# EAGLE design UVBoardFlippingGND (EAGLE 9.5.1)

## Sheet 1 of 2
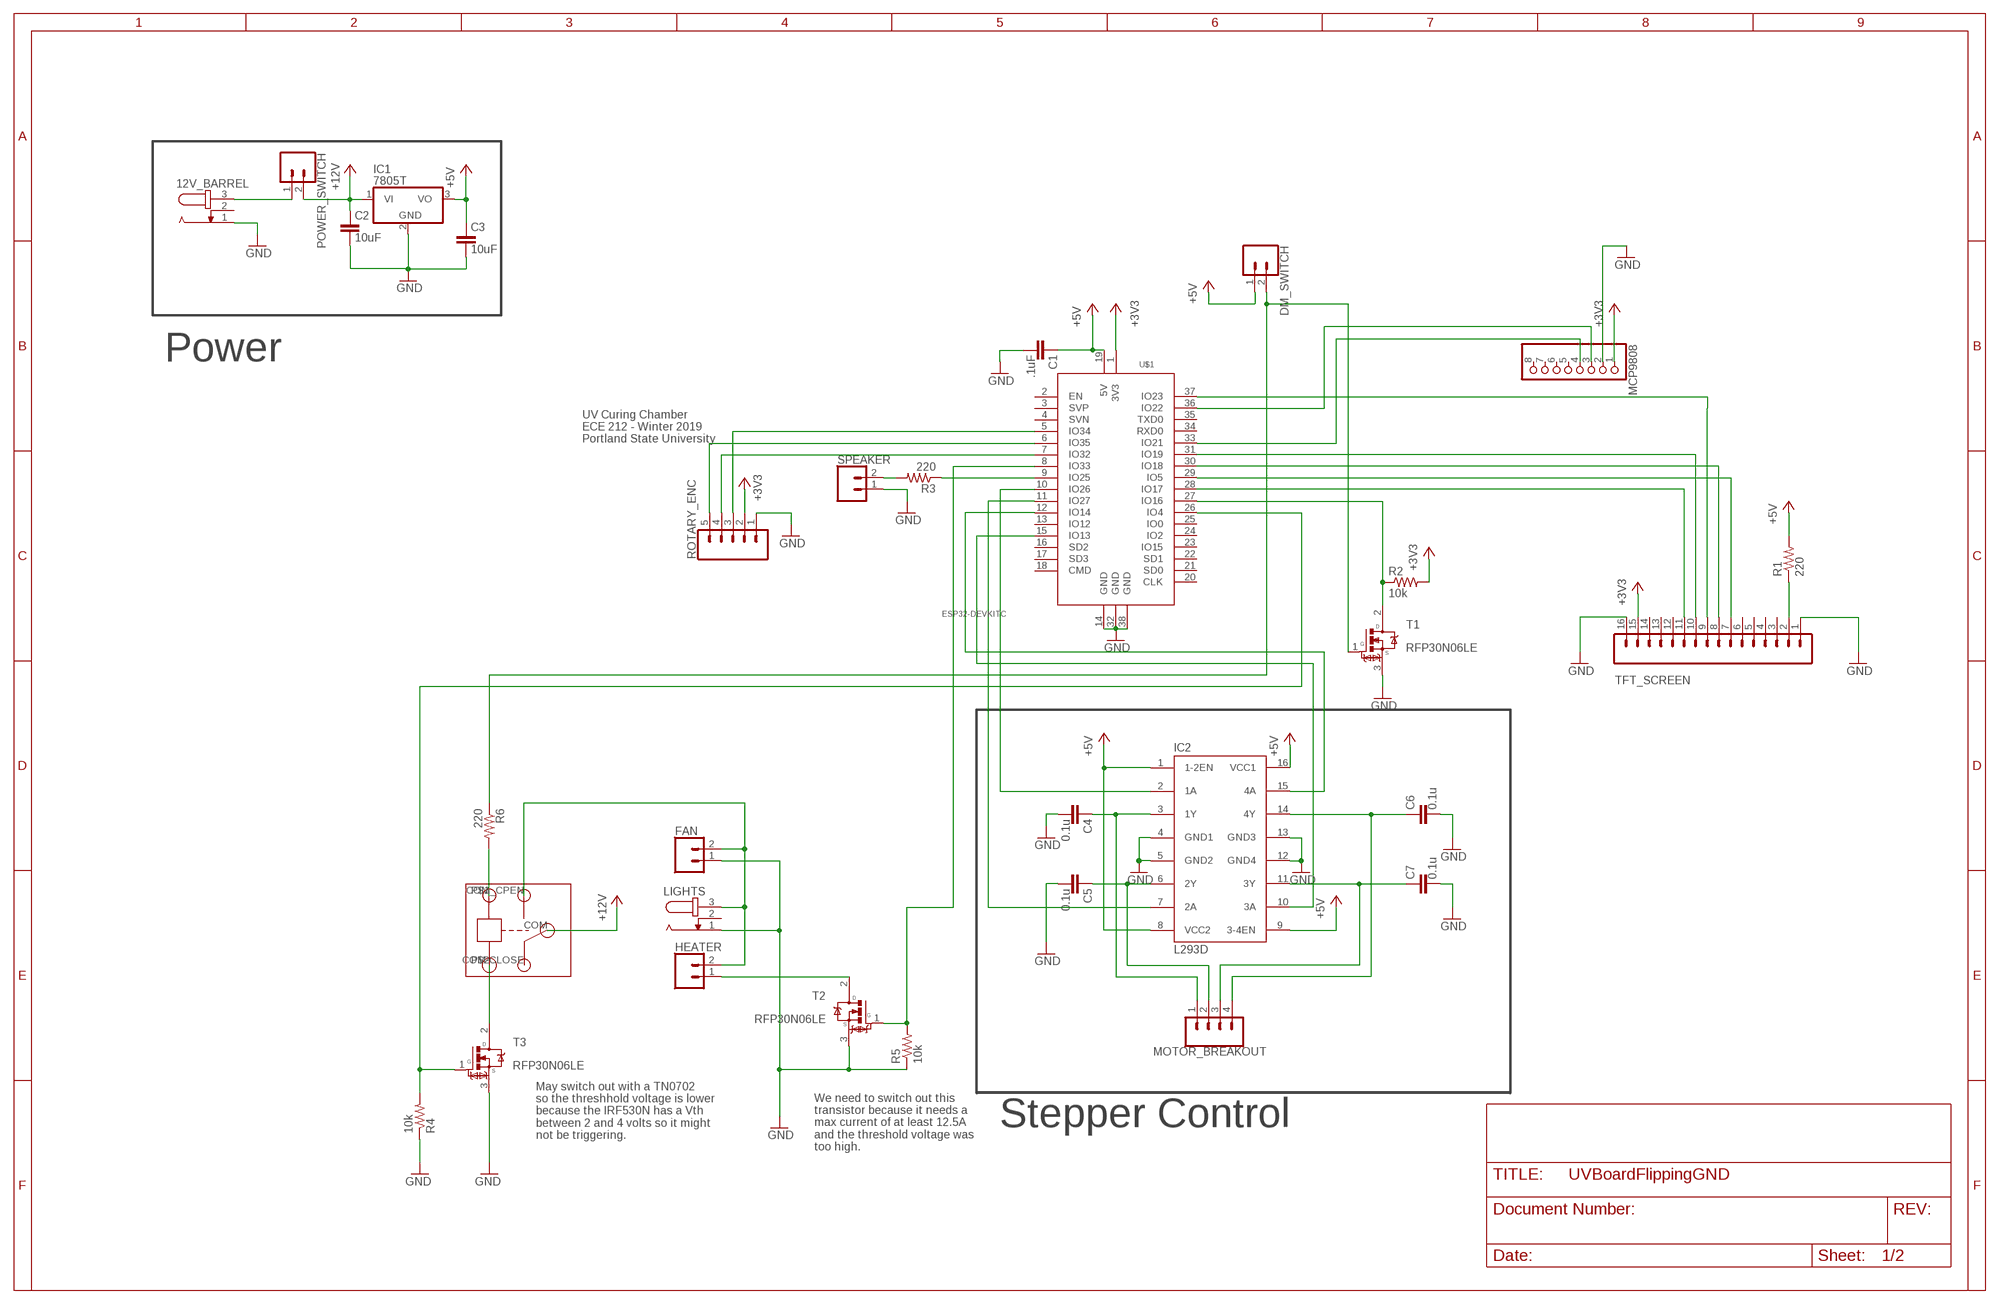
[diagram p0: schematic, sheet 1]

### Parts
12V_BARREL  JACK-PLUG0  [SPC4077]
C1  .1uF  C-EUC0603  [C0603]
C2  10uF  C-EUC1206  [C1206]
C3  10uF  C-EUC1206  [C1206]
C4  0.1u  C-EUC0603  [C0603]
C5  0.1u  C-EUC0603  [C0603]
C6  0.1u  C-EUC0603  [C0603]
C7  0.1u  C-EUC0603  [C0603]
DM_SWITCH  CONN_025MM  [SCREWTERMINAL-5MM-2]
FAN  CONN_025MM  [SCREWTERMINAL-5MM-2]
HEATER  CONN_025MM  [SCREWTERMINAL-5MM-2]
IC1  7805T  [TO220H]
IC2  L293D  [DIL16]
LIGHTS  JACK-PLUG0  [SPC4077]
MCP9808  PINHD-1X8BIG  [1X08-BIG]
MOTOR_BREAKOUT  CONN_04SCREW  [SCREWTERMINAL-3.5MM-4]
POWER_SWITCH  CONN_025MM  [SCREWTERMINAL-5MM-2]
R1  220  R-US_R0805  [R0805]
R2  10k  R-US_R0805  [R0805]
R3  220  R-US_R0805  [R0805]
R4  10k  R-US_R0805  [R0805]
R5  10k  R-US_R0805  [R0805]
R6  220  R-US_R0805  [R0805]
ROTARY_ENC  CONN_05  [1X05]
SPEAKER  CONN_025MM  [SCREWTERMINAL-5MM-2]
T1  RFP30N06LE  [TRANS_RFP30N06LE]
T2  RFP30N06LE  [TRANS_RFP30N06LE]
T3  RFP30N06LE  [TRANS_RFP30N06LE]
TFT_SCREEN  CONN_16  [1X16]
U$1  ESP32DEVKITC  [ESP32-DEVKITC]
U$2  RELAY  [RELAY]

### Nets
+3V3: MCP9808.1 R2.2 ROTARY_ENC.2 TFT_SCREEN.15 U$1.1(3V3)
+5V: C1.1 C3.1 DM_SWITCH.1 IC1.3(VO) IC2.1(1-2EN) IC2.8(VCC2) IC2.9(3-4EN) IC2.16(VCC1) R1.2 U$1.19(5V)
ASDSFA [thick]: C2.1 IC1.1(VI) POWER_SWITCH.2 U$2.COM ; supply symbol labelled +12V
GND: 12V_BARREL.1 C1.2 C2.2 C3.2 C4.2 C5.2 C6.2 C7.2 FAN.1 IC1.2(GND) IC2.4(GND1) IC2.5(GND2) IC2.12(GND4) IC2.13(GND3) LIGHTS.1 MCP9808.2 R4.1 R5.1 ROTARY_ENC.1 SPEAKER.1 T1.3(S) T2.3(S) T3.3(S) TFT_SCREEN.1 TFT_SCREEN.16 U$1.14(GND) U$1.32(GND) U$1.38(GND)
N$1: TFT_SCREEN.9 U$1.37(IO23)
N$2: IC2.15(4A) U$1.12(IO14)
N$3 [thick]: 12V_BARREL.3 POWER_SWITCH.1
N$4: HEATER.1 T2.2(D)
N$5: IC2.7(2A) U$1.11(IO27)
N$6: R3.2 SPEAKER.2
N$7: C5.1 IC2.6(2Y) MOTOR_BREAKOUT.2
N$8: DM_SWITCH.2 R6.1 T1.1(G)
N$9: R2.1 T1.2(D) U$1.27(IO16)
N$10: MCP9808.3 U$1.36(IO22)
N$11: MCP9808.4 U$1.33(IO21)
N$13: IC2.2(1A) U$1.10(IO26)
N$14: R5.2 T2.1(G) U$1.8(IO33)
N$15: C4.1 IC2.3(1Y) MOTOR_BREAKOUT.1
N$16: R4.2 T3.1(G) U$1.26(IO4)
N$17: R1.1 TFT_SCREEN.2
N$18: ROTARY_ENC.3 U$1.5(IO34)
N$19: ROTARY_ENC.4 U$1.7(IO32)
N$20: ROTARY_ENC.5 U$1.6(IO35)
N$21: TFT_SCREEN.11 U$1.28(IO17)
N$22: TFT_SCREEN.10 U$1.31(IO19)
N$23: C7.1 IC2.11(3Y) MOTOR_BREAKOUT.3
N$24: TFT_SCREEN.8 U$1.30(IO18)
N$25: TFT_SCREEN.7 U$1.29(IO5)
N$26: R3.1 U$1.9(IO25)
N$27: C6.1 IC2.14(4Y) MOTOR_BREAKOUT.4
N$28 [thick]: FAN.2 HEATER.2 LIGHTS.3 U$2.COM_CPEN(COM-OPEN)
N$29: IC2.10(3A) U$1.15(IO13)
N$31: T3.2(D) U$2.P$2(GND)
N$32: R6.2 U$2.P$1(IN)
Unconnected: 12V_BARREL.2 LIGHTS.2 MCP9808.5 MCP9808.6 MCP9808.7 MCP9808.8 TFT_SCREEN.3 TFT_SCREEN.4 TFT_SCREEN.5 TFT_SCREEN.6 TFT_SCREEN.12 TFT_SCREEN.13 TFT_SCREEN.14 U$1.2(EN) U$1.3(SVP) U$1.4(SVN) U$1.13(IO12) U$1.16(SD2) U$1.17(SD3) U$1.18(CMD) U$1.20(CLK) U$1.21(SD0) U$1.22(SD1) U$1.23(IO15) U$1.24(IO2) U$1.25(IO0) U$1.34(RXD0) U$1.35(TXD0) U$2.COM-CLOSE

### Notes on the sheet
- Power
- UV Curing Chamber
  ECE 212 - Winter 2019
  Portland State University
- Stepper Control
- May switch out with a TN0702
  so the threshhold voltage is lower
  because the IRF530N has a Vth
  between 2 and 4 volts so it might
  not be triggering.
- We need to switch out this
  transistor because it needs a
  max current of at least 12.5A
  and the threshold voltage was
  too high.

## Sheet 2 of 2

## Library data of the parts
12V_BARREL LIGHTS = con-jack:JACK-PLUG: DC POWER JACK Power Jack, DC, Right Angle, Through Hole, Rated 5A at 16VDC, PC Terminals Distributor: Farnell (www.Farnell.de) Drawing: 84N1161.pdf / 84N1162.pdf Manufacturer: SPC Technology (www.spctechnology.com) Type: SPC4077 / SPC 4078; OC_FARNELL: unknown; OC_NEWARK: unknown
C1-C7 = rcl:C-EU: CAPACITOR, European symbol; SPICEPREFIX: C
DM_SWITCH FAN HEATER POWER_SWITCH SPEAKER = SparkFun-Connectors:CONN_02: Multi connection point. Often used as Generic Header-pin footprint for 0.1 inch spaced/style header connections On any of the 0.1 inch spaced packages, you can populate with these: Break Away Headers - Straight <https://www.sparkfun.com/products/116> (PRT-00116) Break Away Male Headers - Right Angle <https://www.sparkfun.com/products/553> (PRT-00553) Female Headers <https://www.sparkfun.com/products/115> (PRT-00115) Break Away Headers - Machine Pin <https://www.sparkfun.com/products/117> (PRT-00117) Break Away Female Headers - Swiss Machine Pin <https://www.sparkfun.com/products/743> (PRT-00743) For SCREWTERMINALS and SPRING TERMINALS visit here: Screw Terimnals on SparkFun.com <https://www.sparkfun.com/search/results?term=Screw+Terminals> (5mm/3.5mm/2.54mm spacing) This device is also useful as a general connection point to wire up your design to another part of your project. Our various solder wires solder well into these plated through hole pads. Hook-Up Wire - Assortment (Stranded, 22 AWG) <https://www.sparkfun.com/products/11375> (PRT-11375) Hook-Up Wire - Assortment (Solid Core, 22 AWG) <https://www.sparkfun.com/products/11367> (PRT-11367) View the entire wire category on our website here <https://www.sparkfun.com/categories/141> Special notes: Molex polarized connector foot print use with: PRT-08233 with associated crimp pins and housings. 2.54_SCREWTERM for use with PRT-10571. 3.5mm Screw Terminal footprints for PRT-08084 5mm Screw Terminal footprints for use with PRT-08432; SF_SKU: PRT-08432
IC1 = linear:78*: Positive VOLTAGE REGULATOR Source: http://cache.national.com/ds/LM/LM78L05.pdf http://www.fairchildsemi.com/ds/LM/LM7805.pdf
IC2 = st-microelectronics:L293D: PUSH-PULL 4 CHANNEL DRIVER; MPN: L293D; OC_FARNELL: 9589619; OC_NEWARK: 56P8249
MCP9808 = adafruit:PINHD-1X8: PIN HEADER
MOTOR_BREAKOUT = SparkFun-Connectors:CONN_04: Multi connection point. Often used as Generic Header-pin footprint for 0.1 inch spaced/style header connections On any of the 0.1 inch spaced packages, you can populate with these: Break Away Headers - Straight <https://www.sparkfun.com/products/116> (PRT-00116) Break Away Male Headers - Right Angle <https://www.sparkfun.com/products/553> (PRT-00553) Female Headers <https://www.sparkfun.com/products/115> (PRT-00115) Break Away Headers - Machine Pin <https://www.sparkfun.com/products/117> (PRT-00117) Break Away Female Headers - Swiss Machine Pin <https://www.sparkfun.com/products/743> (PRT-00743) For SCREWTERMINALS and SPRING TERMINALS visit here: Screw Terimnals on SparkFun.com <https://www.sparkfun.com/search/results?term=Screw+Terminals> (5mm/3.5mm/2.54mm spacing) This device is also useful as a general connection point to wire up your design to another part of your project. Our various solder wires solder well into these plated through hole pads. Hook-Up Wire - Assortment (Stranded, 22 AWG) <https://www.sparkfun.com/products/11375> (PRT-11375) Hook-Up Wire - Assortment (Solid Core, 22 AWG) <https://www.sparkfun.com/products/11367> (PRT-11367) View the entire wire category on our website here <https://www.sparkfun.com/categories/141> Special notes: Molex polarized connector foot print use with SKU : PRT-08231 with associated crimp pins and housings. 1MM SMD Version SKU: PRT-10208; PROD_ID: 2xCONN-08399; SF_ID: 2xPRT-08084
R1-R6 = rcl:R-US_: RESISTOR, American symbol; SPICEPREFIX: R
ROTARY_ENC = SparkFun-Connectors:CONN_05: Multi connection point. Often used as Generic Header-pin footprint for 0.1 inch spaced/style header connections On any of the 0.1 inch spaced packages, you can populate with these: Break Away Headers - Straight <https://www.sparkfun.com/products/116> (PRT-00116) Break Away Male Headers - Right Angle <https://www.sparkfun.com/products/553> (PRT-00553) Female Headers <https://www.sparkfun.com/products/115> (PRT-00115) Break Away Headers - Machine Pin <https://www.sparkfun.com/products/117> (PRT-00117) Break Away Female Headers - Swiss Machine Pin <https://www.sparkfun.com/products/743> (PRT-00743) For SCREWTERMINALS and SPRING TERMINALS visit here: Screw Terimnals on SparkFun.com <https://www.sparkfun.com/search/results?term=Screw+Terminals> (5mm/3.5mm/2.54mm spacing) This device is also useful as a general connection point to wire up your design to another part of your project. Our various solder wires solder well into these plated through hole pads. Hook-Up Wire - Assortment (Stranded, 22 AWG) <https://www.sparkfun.com/products/11375> (PRT-11375) Hook-Up Wire - Assortment (Solid Core, 22 AWG) <https://www.sparkfun.com/products/11367> (PRT-11367) View the entire wire category on our website here <https://www.sparkfun.com/categories/141> Special notes: Molex polarized connector foot print use with SKU : PRT-08231 with associated crimp pins and housings. 1MM SMD Version SKU: PRT-10208
T1-T3 = RFP30N06LE:RFP30N06LE: Mosfet n-Ch 60v 30a To-220ab - Rfp30n06le; AVAILABILITY: Unavailable; MF: ON Semiconductor; MP: RFP30N06LE; PACKAGE: TO-220 Intersil; PRICE: None
TFT_SCREEN = SparkFun-Connectors:CONN_16: Multi connection point. Often used as Generic Header-pin footprint for 0.1 inch spaced/style header connections On any of the 0.1 inch spaced packages, you can populate with these: Break Away Headers - Straight <https://www.sparkfun.com/products/116> (PRT-00116) Break Away Male Headers - Right Angle <https://www.sparkfun.com/products/553> (PRT-00553) Female Headers <https://www.sparkfun.com/products/115> (PRT-00115) Break Away Headers - Machine Pin <https://www.sparkfun.com/products/117> (PRT-00117) Break Away Female Headers - Swiss Machine Pin <https://www.sparkfun.com/products/743> (PRT-00743) For SCREWTERMINALS and SPRING TERMINALS visit here: Screw Terimnals on SparkFun.com <https://www.sparkfun.com/search/results?term=Screw+Terminals> (5mm/3.5mm/2.54mm spacing) This device is also useful as a general connection point to wire up your design to another part of your project. Our various solder wires solder well into these plated through hole pads. Hook-Up Wire - Assortment (Stranded, 22 AWG) <https://www.sparkfun.com/products/11375> (PRT-11375) Hook-Up Wire - Assortment (Solid Core, 22 AWG) <https://www.sparkfun.com/products/11367> (PRT-11367) View the entire wire category on our website here <https://www.sparkfun.com/categories/141> Special notes: Molex polarized connector foot print use with SKU : PRT-08231 with associated crimp pins and housings. 1MM SMD Version SKU: PRT-10208 NOTES ON THE VARIANTS LOCK and LOCK_LONGPADS... This footprint was designed to help hold the alignment of a through-hole component (i.e. 6-pin header) while soldering it into place. You may notice that each hole has been shifted either up or down by 0.005 of an inch from it's more standard position (which is a perfectly straight line). This slight alteration caused the pins (the squares in the middle) to touch the edges of the holes. Because they are alternating, it causes a "brace" to hold the component in place. 0.005 has proven to be the perfect amount of "off-center" position when using our standard breakaway headers. Although looks a little odd when you look at the bare footprint, once you have a header in there, the alteration is very hard to notice. Also,if you push a header all the way into place, it is covered up entirely on the bottom side.
U$1 = ESP32-DEVKITC:ESP32DEVKITC
U$2 = RELAY:RELAY

## Net classes
0 default: width 0.508 mm, drill 1.5 mm, clearance 0.381 mm
1 thick: width 1.27 mm, drill 1.199 mm, clearance 0.381 mm
2 high current: width 4.318 mm, drill 1.199 mm, clearance 0.381 mm

## Board
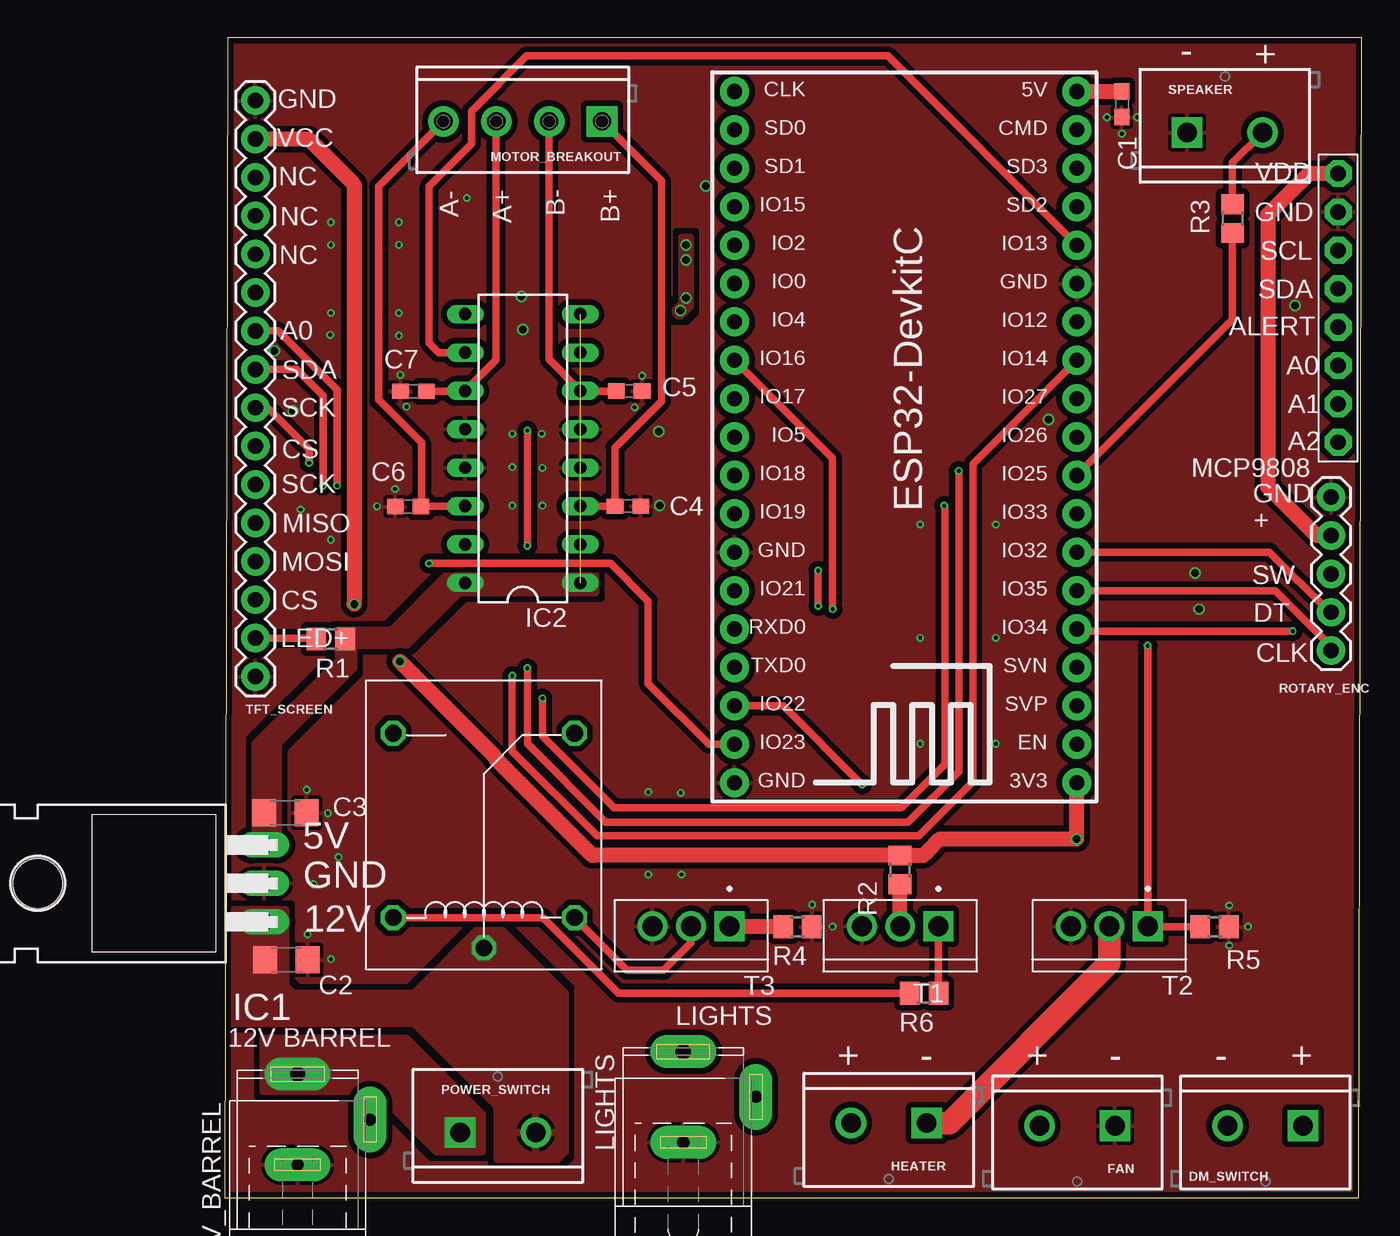
[diagram p1: board, top side]
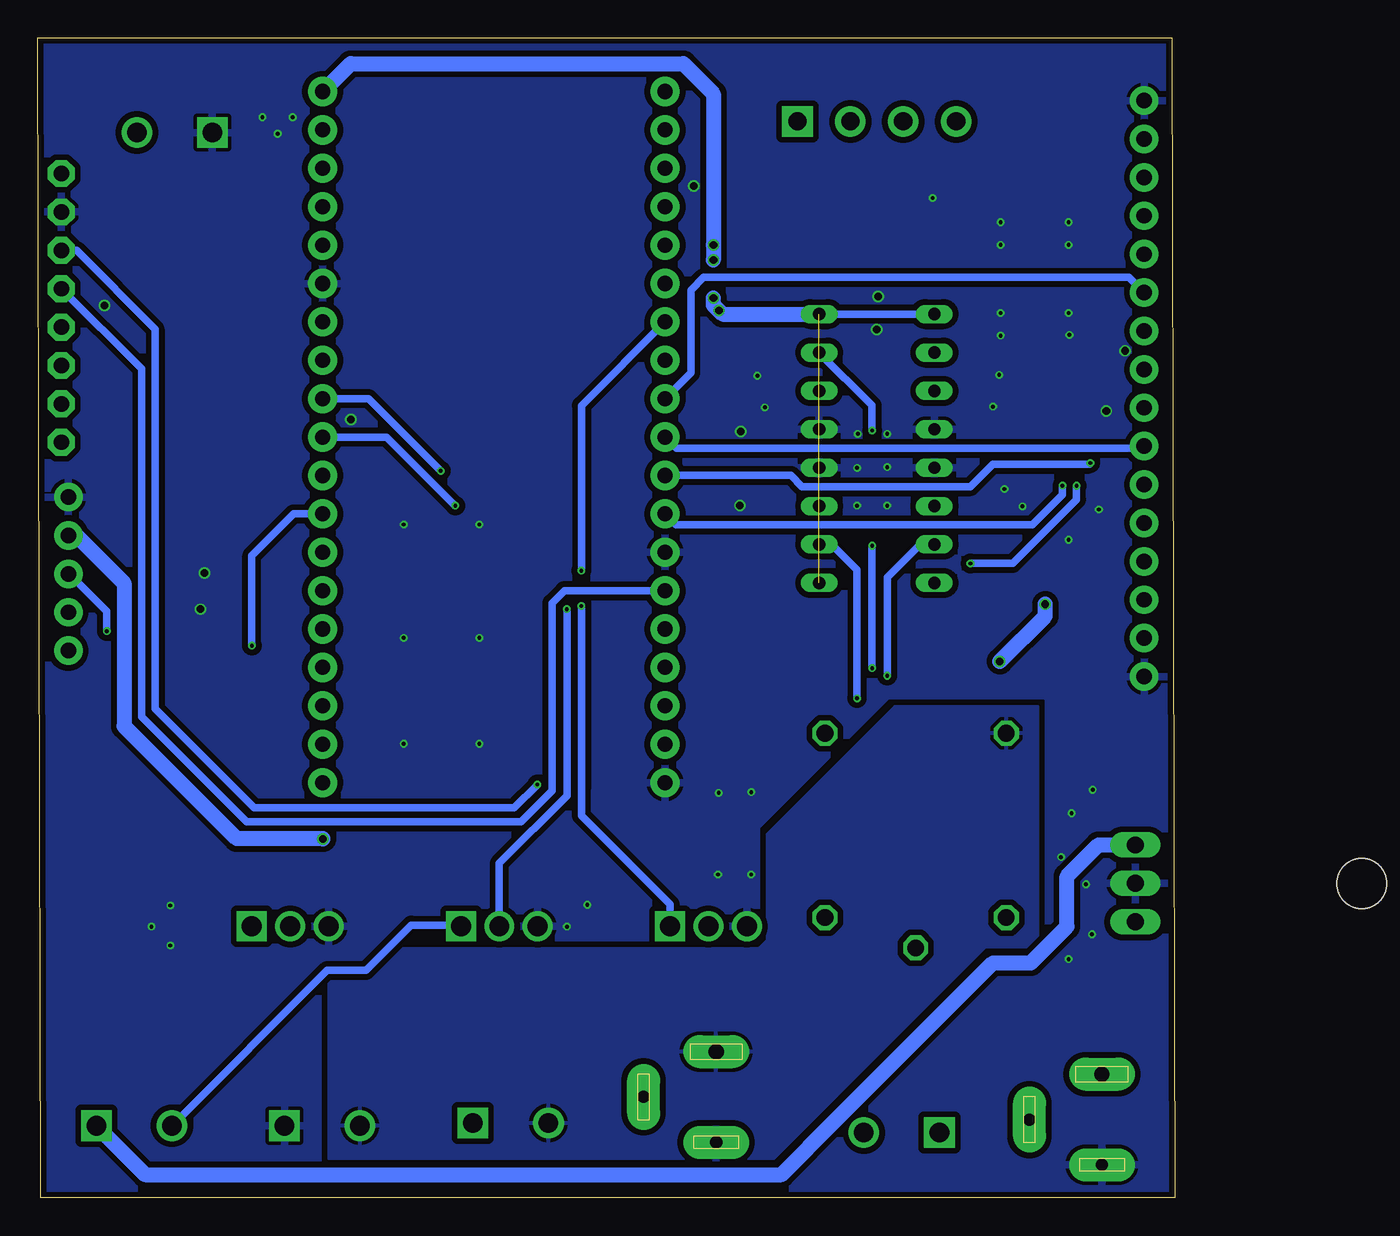
[diagram p2: board, bottom side, seen from below]

Size 75.27 x 76.73 mm. Coordinates in mm from the lower left corner, seen from the top.
Outline: 0,0 75.07,0 75.27,76.73 0.2,76.73 0,0
Copper layers (1*16): Top 0.035559375mm / dielectric 1.6mm / Bottom 0.035559375mm
Design rules "osh2layer": minimum track width 6mil, minimum drill 10mil, track to track 6mil, track to pad 6mil, pad to pad 6mil, via to via 6mil, smd to smd 6mil, copper to edge 15mil, drill to drill 6mil, minimum pad ring 5mil, minimum via ring 5mil, stop-mask expansion 2.5mil, vias tented up to drill 0mil, thermal gap 10mil

### Footprints (pad centres in the part's own frame; a part is rotated, then mirrored left to right if it is on the bottom)
SPC4077 = drill 0.8 pad 2.184 long: 1 -3,0; 2 0,-4.8 | drill 1 pad 2.184 long: 3 3,0
C0603 = smd 1.1 x 1: 1 -0.85,0; 2 0.85,0
C1206 = smd 1.6 x 1.8: 1 -1.4,0; 2 1.4,0
SCREWTERMINAL-5MM-2 = drill 1.3 pad 2.032 square: 1 0,0 | drill 1.3 pad 2.032: 2 5,0
TO220H = drill 1.118 long: 1 -2.54,-10.16; 2 0,-10.16; 3 2.54,-10.16 | hole 3.302: 0,4.826
DIL16 = drill 0.813 long: 1 -8.89,-3.81; 2 -6.35,-3.81; 3 -3.81,-3.81; 4 -1.27,-3.81; 5 1.27,-3.81; 6 3.81,-3.81; 7 6.35,-3.81; 8 8.89,-3.81; 9 8.89,3.81; 10 6.35,3.81; 11 3.81,3.81; 12 1.27,3.81; 13 -1.27,3.81; 14 -3.81,3.81; 15 -6.35,3.81; 16 -8.89,3.81
1X08-BIG = drill 1.016 pad 1.778 octagon: 1 -8.89,0; 2 -6.35,0; 3 -3.81,0; 4 -1.27,0; 5 1.27,0; 6 3.81,0; 7 6.35,0; 8 8.89,0
SCREWTERMINAL-3.5MM-4 = drill 1.2 pad 2.032 square: 1 0,0 | drill 1.2 pad 2.032: 2 3.5,0; 3 7,0; 4 10.5,0
R0805 = smd 1.3 x 1.5: 1 -0.95,0; 2 0.95,0
1X05 = drill 1.016 pad 1.88: 1 0,0; 2 2.54,0; 3 5.08,0; 4 7.62,0; 5 10.16,0
TRANS_RFP30N06LE = drill 1.32 square: 1 -2.54,0 | drill 1.32: 2 0,0; 3 2.54,0
1X16 = drill 1.016 pad 1.88: 1 0,0; 2 2.54,0; 3 5.08,0; 4 7.62,0; 5 10.16,0; 6 12.7,0; 7 15.24,0; 8 17.78,0; 9 20.32,0; 10 22.86,0; 11 25.4,0; 12 27.94,0; 13 30.48,0; 14 33.02,0; 15 35.56,0; 16 38.1,0
ESP32-DEVKITC = drill 1 pad 1.93: 1 -22.87,-11.42; 2 -20.33,-11.42; 3 -17.79,-11.42; 4 -15.25,-11.42; 5 -12.71,-11.42; 6 -10.17,-11.42; 7 -7.63,-11.42; 8 -5.09,-11.42; 9 -2.55,-11.42; 10 -0.01,-11.42; 11 2.53,-11.42; 12 5.07,-11.42; 13 7.61,-11.42; 14 10.15,-11.42; 15 12.69,-11.42; 16 15.23,-11.42; 17 17.77,-11.42; 18 20.31,-11.42; 19 22.85,-11.42; 20 22.85,11.23; 21 20.31,11.23; 22 17.77,11.23; 23 15.23,11.23; 24 12.69,11.23; 25 10.15,11.23; 26 7.61,11.23; 27 5.07,11.23; 28 2.53,11.23; 29 -0.01,11.23; 30 -2.55,11.23; 31 -5.09,11.23; 32 -7.63,11.23; 33 -10.17,11.23; 34 -12.71,11.23; 35 -15.25,11.23; 36 -17.79,11.23; 37 -20.33,11.23; 38 -22.87,11.23
RELAY = drill 1.1 octagon: COM -2,0; COM-CLOSE 12.2,-6; COM_CPEN 12.2,6; P$1 0,6; P$2 0,-6

### Placement (x,y rotation side)
12V_BARREL  4.84,5.16 90 top
C1  59.4,72.34 270 top
C2  4.1,15.74 0 top
C3  4.04,25.46 0 top
C4  26.7,45.75 0 top
C5  26.79,53.36 0 top
C6  12.16,45.72 180 top
C7  12.51,53.36 180 top
DM_SWITCH  71.39,4.76 180 top
FAN  58.94,4.76 180 top
HEATER  46.47,4.93 180 top
IC1  -7.53,20.79 90 top
IC2  19.74,49.56 90 top
LIGHTS  30.37,6.66 90 top
MCP9808  73.71,58.86 270 top
MOTOR_BREAKOUT  24.99,71.2 180 top
POWER_SWITCH  15.6,4.3 0 top
R1  7.03,36.95 0 top
R2  44.71,21.69 90 top
R3  66.72,64.77 90 top
R4  37.93,17.92 180 top
R5  65.52,17.92 180 top
R6  46.31,13.52 180 top
ROTARY_ENC  73.24,46.35 270 top
SPEAKER  63.71,70.46 0 top
T1  44.72,17.95 180 top
T2  58.56,17.95 180 top
T3  30.88,17.95 180 top
TFT_SCREEN  2.05,34.48 90 top
U$1  44.99,50.33 90 top
U$2  17.17,18.53 90 top

### Tracks (layer width: path | path; a pad name or v marks a point on that pad's centre or on a via)
+3V3  (via drill 0.5 pad 0.5)
  Top 1: MCP9808.1 71.77,67.75 69.05,65.03 69.05,47.03 72.27,43.81 ROTARY_ENC.2 | U$1.1 56.33,27.46 | 56.43,27.44 U$1.1 | U$1.1 56.41,23.74 v56.4,23.73 47.35,23.73 46.52,22.9 46.51,22.9 46.26,22.64 R2.2 24.34,22.64 17.91,29.06 17.91,29.17 v11.6,35.48 | TFT_SCREEN.15 2.06,70.02 5.6,70.02 8.58,67.04 8.58,39.27 v8.6,39.26
  Bottom 1: ROTARY_ENC.2 72.71,43.81 69.55,40.65 69.55,31.19 62.1,23.75 56.41,23.75 v56.4,23.73 | v11.6,35.48 8.6,38.48 v8.6,39.26
+5V  (via drill 0.5, 0.5 pad 0.5)  (1 unrouted)
  Top 1: C1.1 59.39,73.18 U$1.19
  Bottom 0.508: IC2.9 IC2.8
  Bottom 1: IC2.8 29.95,58.45 v30.19,58.69 30.55,59.05 v30.55,59.53 | U$1.19 54.56,75.03 32.55,75.03 30.55,73.03 v30.55,63.03 v30.55,62.03 | DM_SWITCH.1 68.16,1.53 26.05,1.53 22.5,5.08 22.5,5.09 21.39,6.2 21.38,6.2 12.05,15.53 9.55,15.53 7.16,17.92 7.16,21.25 5.08,23.33 IC1.3
  pour Top (no thermals): 7.55,37.53 11.05,37.53 14.75,41.23 24.55,41.23 24.55,40.03 15.55,40.03 12.05,36.53 7.55,36.53
  pour Top (no thermals): 2.05,30.03 2.05,23.03 3.55,23.03 3.55,30.03 8.55,35.03 8.55,37.53 7.55,37.53 7.55,35.53
  pour Top (no thermals): 30.3,63.53 30.3,59.18 29.75,58.63 30.12,58.26 30.8,58.93 30.8,63.53
ASDSFA
  pour Top (no thermals): 0.55,15.03 4.05,15.03 4.05,19.03 0.55,19.03
  pour Top (no thermals): 4.05,16.53 4.05,14.03 4.55,13.53 12.55,13.53 17.3,18.28 19.05,16.53 14.05,11.53 0.55,11.53 0.55,16.53
  pour Top: 18.05,2.53 22.05,2.53 22.55,3.03 22.55,13.53 17.55,18.53 11.55,12.53 18.05,6.03
GND  (via drill 0.25 pad 0.5, 0.5 pad 0.5)
  other vias: 28.8,45.78 11.3,46.88 10.1,45.73 7,57.08 4.55,52.03 3.3,56.03 31.85,66.93 54.55,51.48 70.85,59.03 19.05,45.78 19.05,48.33 21.05,48.28 21.05,45.78 21,50.53 19.05,50.53 19.65,59.63 19.75,57.43 16.05,66.13 64.25,41.33 64.5,38.93 28.75,50.68 5.9,20.73 5.5,17.43 7.05,15.78 6.85,25.43 5.45,26.98 67.75,17.93 66.5,19.33 66.5,16.68 27.65,54.38 27.15,52.28 11.65,54.43 12.05,52.33 58.4,71.48 59.4,70.38 60.4,71.48 30.25,21.38 30.2,26.78 28.05,26.83 28.05,21.38 7.55,22.53 11.55,57.03 11.55,58.53 11.55,63.03 11.55,64.53 7.05,64.53 7.05,63.03 7.05,58.53 46.05,44.53 51.05,44.53 51.05,37.03 46.05,37.03 46.05,30.03 51.05,30.03 40.25,17.93 38.9,19.38 7.05,43.53 5.05,45.53
  pour Top (rank 6): -0.1,77.41 -0.1,-1.29 78.13,-1.29 78.13,77.41
  pour Bottom (rank 6): 0.05,77.53 75.55,77.53 75.55,0.03 0.05,0.03
N$1  (via drill 0.25 pad 0.5)
  Top 0.508: TFT_SCREEN.9 4.78,54.8 6.52,53.06 v6.52,47.1 | U$1.37 32.06,30 28.05,34.01 28.05,39.46 25.55,41.96 v13.55,41.96
  Bottom 0.508: v6.52,47.1 6.52,46.18 10.74,41.96 v13.55,41.96
N$2  (via drill 0.25)
  Top 0.508: v19.05,34.53 19.05,29.53 24.65,23.93 45.95,23.93 49.55,27.53 49.55,48.54 U$1.12
  Bottom 0.508: IC2.15 16.87,43.21 19.05,41.03 v19.05,34.53
N$3
  pour Top (no thermals): 2.55,7.03 10.05,7.03 14.05,3.03 17.05,3.03 17.05,5.53 12.05,10.53 2.55,10.53
N$4
  Top 1.5: HEATER.1 47.97,4.93 58.56,15.53 T2.2
N$5  (via drill 0.25)
  Top 0.508: v20.05,50.75 v20.05,43.13 | v20.05,35.03 20.05,30.03 25.24,24.84 45.25,24.84 48.6,28.19 v48.6,48.08
  Bottom 0.508: IC2.7 20.05,52.41 v20.05,50.75 | v20.05,43.13 v20.05,35.03 | U$1.11 53.38,52.86 v48.6,48.08
N$6
  Top 0.508: SPEAKER.2 66.72,68.47 R3.2
N$7
  Top 0.508: C5.1 23.56,53.36 IC2.6 22.49,54.43 22.49,54.47 21.49,55.47 MOTOR_BREAKOUT.2
N$8
  Top 0.508: R6.1 T1.1
  Bottom 0.508: DM_SWITCH.2 56.12,15.03 53.55,15.03 50.55,18.03 47.35,18.03 T1.1
N$9  (via drill 0.25)
  Top 0.508: v40.25,38.94 40.25,48.9 U$1.27
  Top 1: T1.2 44.7,17.96 R2.1
  Bottom 0.508: T1.2 44.72,22.11 40.25,26.59 40.25,38.93 v40.25,38.94
N$10  (via drill 0.25 pad 0.25)
  Top 0.508: U$1.36 37.01,32.53 v42.21,27.33
  Bottom 0.508: MCP9808.3 72.71,62.67 67.5,57.46 67.5,32.33 60.95,25.78 43.75,25.78 v42.21,27.32 v42.21,27.33
N$11
  Bottom 0.508: MCP9808.4 68.4,54.82 68.4,31.83 61.45,24.88 43.3,24.88 41.25,26.93 41.25,39.33 40.42,40.16 U$1.33
N$13  (via drill 0.25)
  Top 0.508: v21.05,33.03 21.05,30.53 25.8,25.78 44.8,25.78 47.7,28.68 47.7,45.72 v47.64,45.78
  Bottom 0.508: IC2.2 22.73,43.21 21.05,41.53 v21.05,33.03 | v47.64,45.78 47.66,45.78 52.19,50.32 U$1.10
N$14  (via drill 0.25 pad 0.5)
  Top 0.508: R5.2 61.13,17.92 T2.1 v61.1,36.52
  Bottom 0.508: v61.1,36.52 61.1,42.48 58.34,45.24 U$1.8
N$15
  Top 0.508: IC2.3 C4.1 25.85,49.63 28.93,52.7 28.93,67.27 MOTOR_BREAKOUT.1
N$16  (via drill 0.25 pad 0.5)
  Top 0.508: v39.29,41.48 v39.29,39.15
  Top 1: R4.2 33.45,17.92 T3.1
  Bottom 0.508: v39.29,39.15 39.29,27.03 39.29,25.28 33.42,19.41 T3.1 | v39.29,41.48 39.29,52.4 U$1.26
N$17
  Top 0.508: TFT_SCREEN.2 6.02,37.02 R1.1
N$18  (via drill 0.25 pad 0.25)
  Top 0.508: U$1.5 56.55,37.48 v70.7,37.48
  Bottom 0.508: v70.7,37.48 70.7,38.78 73.19,41.27 ROTARY_ENC.3
N$19
  Top 0.508: ROTARY_ENC.4 73.14,38.73 69.17,42.71 56.42,42.71 U$1.7
N$20
  Top 0.508: ROTARY_ENC.5 73.24,36.46 69.54,40.16 U$1.6
N$21
  Bottom 0.508: U$1.28 32.05,54.57 32.05,60.03 31.2,60.88 3.05,60.88 TFT_SCREEN.11
N$22  (via drill 0.25 pad 0.5)
  Top 0.508: v7.45,47.11 7.45,53.44 3.55,57.34 TFT_SCREEN.10
  Bottom 0.508: U$1.31 33.02,44.51 9.45,44.51 7.45,46.51 v7.45,47.11
N$23
  Top 0.508: C7.1 IC2.11 17.99,55.43 MOTOR_BREAKOUT.3
N$24  (via drill 0.25 pad 0.5)
  Top 0.508: v5.61,48.61 5.61,49.03 5.61,49.52 2.87,52.26 TFT_SCREEN.8
  Bottom 0.508: U$1.30 25.41,47.78 24.68,47.05 13.53,47.05 12.05,48.53 5.69,48.53 v5.61,48.61
N$25
  Bottom 0.508: TFT_SCREEN.7 2.2,49.57 33.01,49.57 U$1.29
N$26
  Top 0.508: U$1.9 66.72,58.09 R3.1
N$27
  Top 0.508: C6.1 13.04,45.75 | 13.04,45.75 IC2.14 | 13.04,45.75 13.05,45.76 13.05,49.93 10.2,52.78 10.2,66.91 MOTOR_BREAKOUT.4
N$28
  pour Bottom: 9.05,32.53 9.05,17.03 9.55,16.53 12.55,16.53 26.55,2.53 56.05,2.53 56.05,14.53 53.55,14.53 51.55,16.53 27.55,16.53 27.05,17.03 27.05,24.03 18.55,32.53
N$29
  Top 0.508: IC2.10 14.17,55.91 13.55,56.53 13.55,66.92 16.34,69.72 16.34,71.89 19.98,75.53 43.9,75.53 U$1.15
N$31
  Top 0.508: T3.2 30.88,16.87 29.05,15.03 26.65,15.03 23.17,18.51 U$2.P$2
N$32
  Top 0.508: R6.2 26.1,13.53 21.1,18.53 U$2.P$1

### Text on the board
tPlace: GND | VCC | VDD | NC | A- | A+ | B- | B+ | NC | GND | SCL | NC | SDA | ALERT | A0 | SDA | A0 | SCK | A1 | A2 | CS | SCK | GND | + | MISO | MOSI | SW | CS | DT | LED+ | CLK | 5V | GND | 12V | 12V BARREL | LIGHTS
tNames: - | + | + | - | + | - | - | +